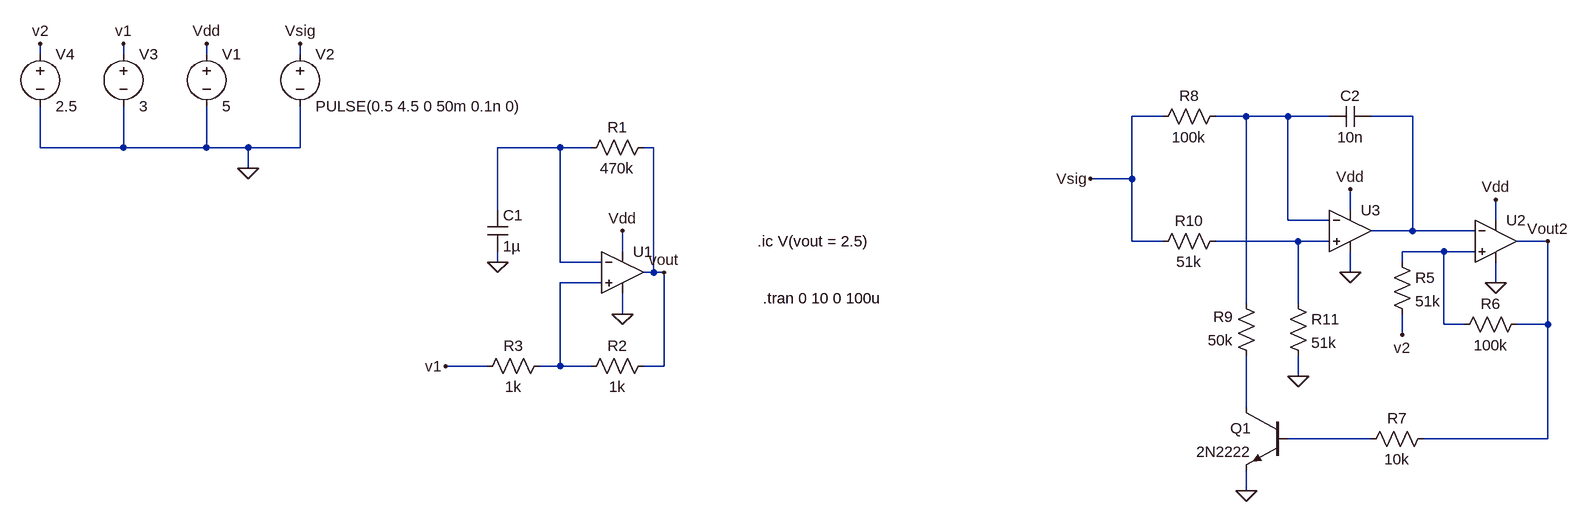
[diagram p0: schematic pressureSensorVCO.asc]
pressureSensorVCO.asc, the LTspice schematic file:
Version 4
SHEET 1 1704 680
WIRE -672 -160 -672 -176
WIRE -544 -160 -544 -176
WIRE -416 -160 -416 -176
WIRE -272 -160 -272 -176
WIRE 1056 -64 1008 -64
WIRE 1184 -64 1136 -64
WIRE 1248 -64 1184 -64
WIRE 1312 -64 1248 -64
WIRE 1440 -64 1376 -64
WIRE -672 -16 -672 -80
WIRE -544 -16 -544 -80
WIRE -544 -16 -672 -16
WIRE -416 -16 -416 -80
WIRE -416 -16 -544 -16
WIRE -352 -16 -416 -16
WIRE -272 -16 -272 -80
WIRE -272 -16 -352 -16
WIRE 128 -16 32 -16
WIRE 176 -16 128 -16
WIRE 272 -16 256 -16
WIRE -352 16 -352 -16
WIRE 1008 32 1008 -64
WIRE 1008 32 944 32
WIRE 32 80 32 -16
WIRE 1344 80 1344 48
WIRE 1248 96 1248 -64
WIRE 1312 96 1248 96
WIRE 1568 96 1568 64
WIRE 1440 112 1440 -64
WIRE 1440 112 1376 112
WIRE 1536 112 1440 112
WIRE 1008 128 1008 32
WIRE 1056 128 1008 128
WIRE 1264 128 1136 128
WIRE 1312 128 1264 128
WIRE 1648 128 1600 128
WIRE 224 144 224 112
WIRE 1488 144 1424 144
WIRE 1536 144 1488 144
WIRE 32 160 32 144
WIRE 128 160 128 -16
WIRE 192 160 128 160
WIRE 1424 160 1424 144
WIRE 272 176 272 -16
WIRE 272 176 256 176
WIRE 288 176 272 176
WIRE 1344 176 1344 144
WIRE 192 192 128 192
WIRE 1568 192 1568 160
WIRE 1184 224 1184 -64
WIRE 1264 224 1264 128
WIRE 224 240 224 208
WIRE 1488 256 1488 144
WIRE 1520 256 1488 256
WIRE 1648 256 1648 128
WIRE 1648 256 1600 256
WIRE 1424 272 1424 240
WIRE 16 320 -48 320
WIRE 128 320 128 192
WIRE 128 320 96 320
WIRE 176 320 128 320
WIRE 288 320 288 176
WIRE 288 320 256 320
WIRE 1264 336 1264 304
WIRE 1184 384 1184 304
WIRE 1376 432 1248 432
WIRE 1648 432 1648 256
WIRE 1648 432 1456 432
WIRE 1184 512 1184 480
FLAG 32 160 0
FLAG 224 240 0
FLAG -352 16 0
FLAG -416 -176 Vdd
FLAG -272 -176 Vsig
FLAG -48 320 v1
FLAG 224 112 Vdd
FLAG 288 176 vout
FLAG -544 -176 v1
FLAG 1184 512 0
FLAG 1264 336 0
FLAG 1568 192 0
FLAG 1568 64 Vdd
FLAG 944 32 Vsig
FLAG -672 -176 v2
FLAG 1424 272 v2
FLAG 1344 48 Vdd
FLAG 1344 176 0
FLAG 1648 128 Vout2
SYMBOL voltage -416 -176 R0
WINDOW 123 0 0 Left 2
WINDOW 39 0 0 Left 2
SYMATTR InstName V1
SYMATTR Value 5
SYMBOL voltage -272 -176 R0
WINDOW 123 0 0 Left 2
WINDOW 39 0 0 Left 2
SYMATTR InstName V2
SYMATTR Value PULSE(0.5 4.5 0 50m 0.1n 0)
SYMBOL res 160 0 R270
WINDOW 0 32 56 VTop 2
WINDOW 3 0 56 VBottom 2
SYMATTR InstName R1
SYMATTR Value 470k
SYMATTR SpiceLine tol=1
SYMBOL res 272 304 R90
WINDOW 0 0 56 VBottom 2
WINDOW 3 32 56 VTop 2
SYMATTR InstName R2
SYMATTR Value 1k
SYMATTR SpiceLine tol=1
SYMBOL res 112 304 R90
WINDOW 0 0 56 VBottom 2
WINDOW 3 32 56 VTop 2
SYMATTR InstName R3
SYMATTR Value 1k
SYMATTR SpiceLine tol=1
SYMBOL cap 16 80 R0
SYMATTR InstName C1
SYMATTR Value 1µ
SYMATTR SpiceLine Rser=0.1
SYMBOL Opamps\\UniversalOpamp2 224 176 R0
SYMATTR InstName U1
SYMBOL voltage -544 -176 R0
WINDOW 123 0 0 Left 2
WINDOW 39 0 0 Left 2
SYMATTR InstName V3
SYMATTR Value 3
SYMBOL Opamps\\UniversalOpamp2 1568 128 R0
SYMATTR InstName U2
SYMBOL Opamps\\UniversalOpamp2 1344 112 R0
SYMATTR InstName U3
SYMBOL res 1408 144 R0
SYMATTR InstName R5
SYMATTR Value 51k
SYMBOL res 1616 240 R90
WINDOW 0 0 56 VBottom 2
WINDOW 3 32 56 VTop 2
SYMATTR InstName R6
SYMATTR Value 100k
SYMBOL res 1472 416 R90
WINDOW 0 0 56 VBottom 2
WINDOW 3 32 56 VTop 2
SYMATTR InstName R7
SYMATTR Value 10k
SYMBOL res 1152 -80 R90
WINDOW 0 0 56 VBottom 2
WINDOW 3 32 56 VTop 2
SYMATTR InstName R8
SYMATTR Value 100k
SYMBOL res 1200 320 R180
WINDOW 0 36 76 Left 2
WINDOW 3 36 40 Left 2
SYMATTR InstName R9
SYMATTR Value 50k
SYMBOL res 1040 144 R270
WINDOW 0 32 56 VTop 2
WINDOW 3 0 56 VBottom 2
SYMATTR InstName R10
SYMATTR Value 51k
SYMBOL res 1248 208 R0
SYMATTR InstName R11
SYMATTR Value 51k
SYMBOL cap 1376 -80 R90
WINDOW 0 0 32 VBottom 2
WINDOW 3 32 32 VTop 2
SYMATTR InstName C2
SYMATTR Value 10n
SYMBOL npn 1248 384 M0
SYMATTR InstName Q1
SYMATTR Value 2N2222
SYMBOL voltage -672 -176 R0
WINDOW 123 0 0 Left 2
WINDOW 39 0 0 Left 2
SYMATTR InstName V4
SYMATTR Value 2.5
TEXT 432 128 Left 2 !.ic V(vout = 2.5)
TEXT 440 216 Left 2 !.tran 0 10 0 100u

The netlist it stands for:
* pressureSensorVCO.asc
V1 Vdd 0 5
V2 Vsig 0 PULSE(0.5 4.5 0 50m 0.1n 0)
R1 N003 vout 470k tol=1
R2 vout N006 1k tol=1
R3 N006 v1 1k tol=1
C1 N003 0 1µ Rser=0.1
XU1 N006 N003 Vdd 0 vout level.2 Avol=1Meg GBW=10Meg Slew=10Meg ilimit=25m rail=0 Vos=0 phimargin=45 en=0 enk=0 in=0 ink=0 Rin=500Meg  ; pins IN+ IN- V+ V- OUT
V3 v1 0 3
XU2 N005 N002 Vdd 0 Vout2 level.2 Avol=1Meg GBW=10Meg Slew=10Meg ilimit=25m rail=0 Vos=0 phimargin=45 en=0 enk=0 in=0 ink=0 Rin=500Meg  ; pins IN+ IN- V+ V- OUT
XU3 N004 N001 Vdd 0 N002 level.2 Avol=1Meg GBW=10Meg Slew=10Meg ilimit=25m rail=0 Vos=0 phimargin=45 en=0 enk=0 in=0 ink=0 Rin=500Meg  ; pins IN+ IN- V+ V- OUT
R5 N005 v2 51k
R6 Vout2 N005 100k
R7 Vout2 N008 10k
R8 N001 Vsig 100k
R9 N007 N001 50k
R10 Vsig N004 51k
R11 N004 0 51k
C2 N002 N001 10n
Q1 N007 N008 0 0 2N2222
V4 v2 0 2.5
.model NPN NPN
.model PNP PNP
.lib standard.bjt
.ic V(vout = 2.5)
.tran 0 10 0 100u
.lib UniversalOpamps2.sub
.backanno
.end